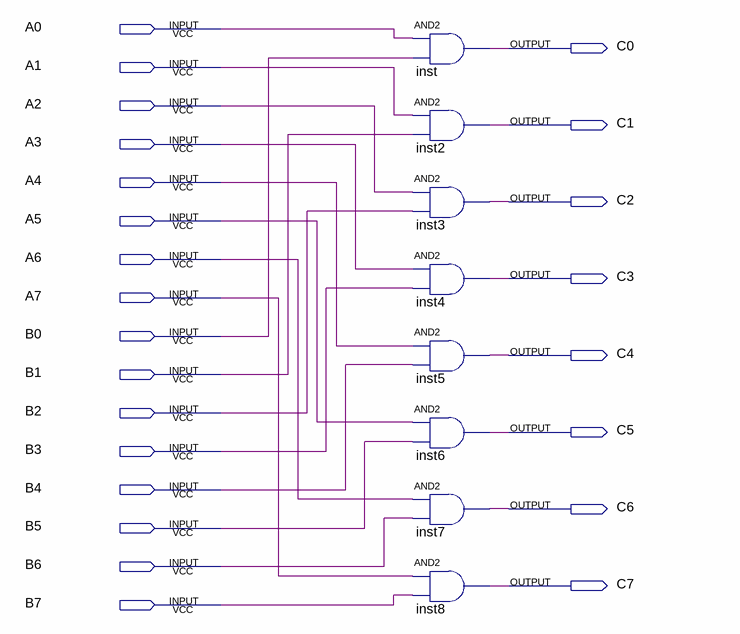
[diagram p0: schematic sheet]
// Quartus schematic and8.bdf as structural Verilog: 8 symbols, 24 pins
module and8 (
  input  A0,
  input  A1,
  input  A2,
  input  A3,
  input  A4,
  input  A5,
  input  A6,
  input  A7,
  input  B0,
  input  B1,
  input  B2,
  input  B3,
  input  B4,
  input  B5,
  input  B6,
  input  B7,
  output C0,
  output C1,
  output C2,
  output C3,
  output C4,
  output C5,
  output C6,
  output C7
);

  and inst (C0, A0, B0);
  and inst2 (C1, A1, B1);
  and inst3 (C2, A2, B2);
  and inst4 (C3, A3, B3);
  and inst5 (C4, A4, B4);
  and inst6 (C5, A5, B5);
  and inst7 (C6, A6, B6);
  and inst8 (C7, A7, B7);
endmodule
